# EAGLE design Analog_Slave (EAGLE 7.4.0)
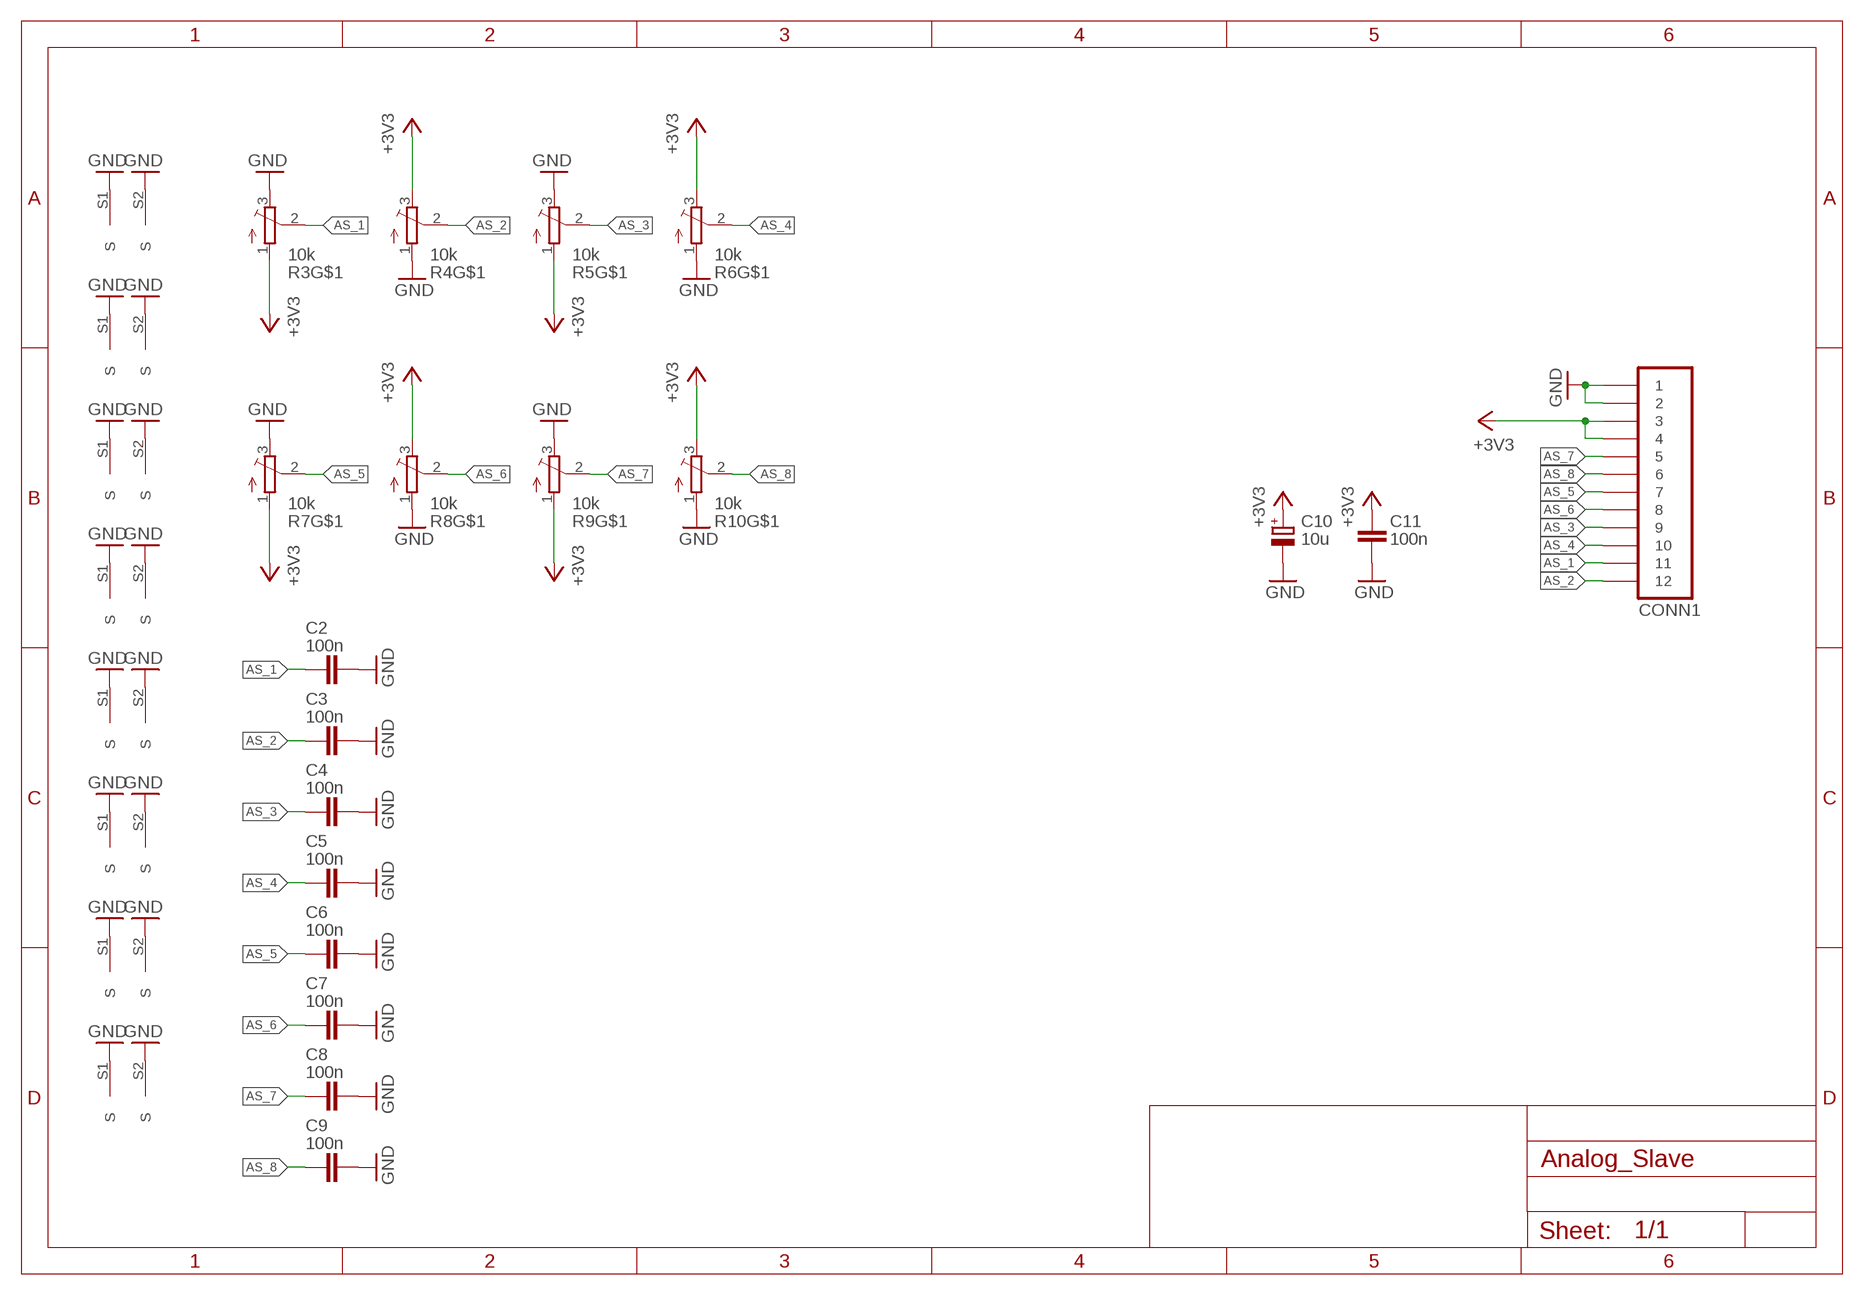
[diagram p0: schematic, sheet 1]

## Parts
C2  100n  CAPACITOR-0805  [C0805]
C3  100n  CAPACITOR-0805  [C0805]
C4  100n  CAPACITOR-0805  [C0805]
C5  100n  CAPACITOR-0805  [C0805]
C6  100n  CAPACITOR-0805  [C0805]
C7  100n  CAPACITOR-0805  [C0805]
C8  100n  CAPACITOR-0805  [C0805]
C9  100n  CAPACITOR-0805  [C0805]
C10  10u  ELECTROLYTIC_CAPACITOR16V-CLV-0405  [153CLV-0405]
C11  100n  CAPACITOR-0805  [C0805]
CONN1  PINHD-2X06-IDC-2.54-V  [IDC-12P-2.54]
R3  10k  PTV09A-4025F-B103  [PTV09A-4025F-B103]
R4  10k  PTV09A-4025F-B103  [PTV09A-4025F-B103]
R5  10k  PTV09A-4025F-B103  [PTV09A-4025F-B103]
R6  10k  PTV09A-4025F-B103  [PTV09A-4025F-B103]
R7  10k  PTV09A-4025F-B103  [PTV09A-4025F-B103]
R8  10k  PTV09A-4025F-B103  [PTV09A-4025F-B103]
R9  10k  PTV09A-4025F-B103  [PTV09A-4025F-B103]
R10  10k  PTV09A-4025F-B103  [PTV09A-4025F-B103]

## Nets
+3V3: C10.+ C11.1 CONN1.3 CONN1.4 R3.1 R4.3 R5.1 R6.3 R7.1 R8.3 R9.1 R10.3
AS_1: C2.1 CONN1.11 R3.2
AS_2: C3.1 CONN1.12 R4.2
AS_3: C4.1 CONN1.9 R5.2
AS_4: C5.1 CONN1.10 R6.2
AS_5: C6.1 CONN1.7 R7.2
AS_6: C7.1 CONN1.8 R8.2
AS_7: C8.1 CONN1.5 R9.2
AS_8: C9.1 CONN1.6 R10.2
GND: C2.2 C3.2 C4.2 C5.2 C6.2 C7.2 C8.2 C9.2 C10.- C11.2 CONN1.1 CONN1.2 R3.3 R3.S1(S) R3.S2(S) R4.1 R4.S1(S) R4.S2(S) R5.3 R5.S1(S) R5.S2(S) R6.1 R6.S1(S) R6.S2(S) R7.3 R7.S1(S) R7.S2(S) R8.1 R8.S1(S) R8.S2(S) R9.3 R9.S1(S) R9.S2(S) R10.1 R10.S1(S) R10.S2(S)

## Library data of the parts
C2-C9 C11 = igor_lbr:CAPACITOR: Capacitor
C10 = igor_lbr:ELECTROLYTIC_CAPACITOR: Electrolytic capacitor; MANUFACTURER: Multicomp; MPN: MCVVT016M100CA1L
CONN1 = igor_lbr:PINHD-2X06: Pin Header
R3-R10 = igor_lbr:PTV09A-4025F-B103: Potentiometer

## Board
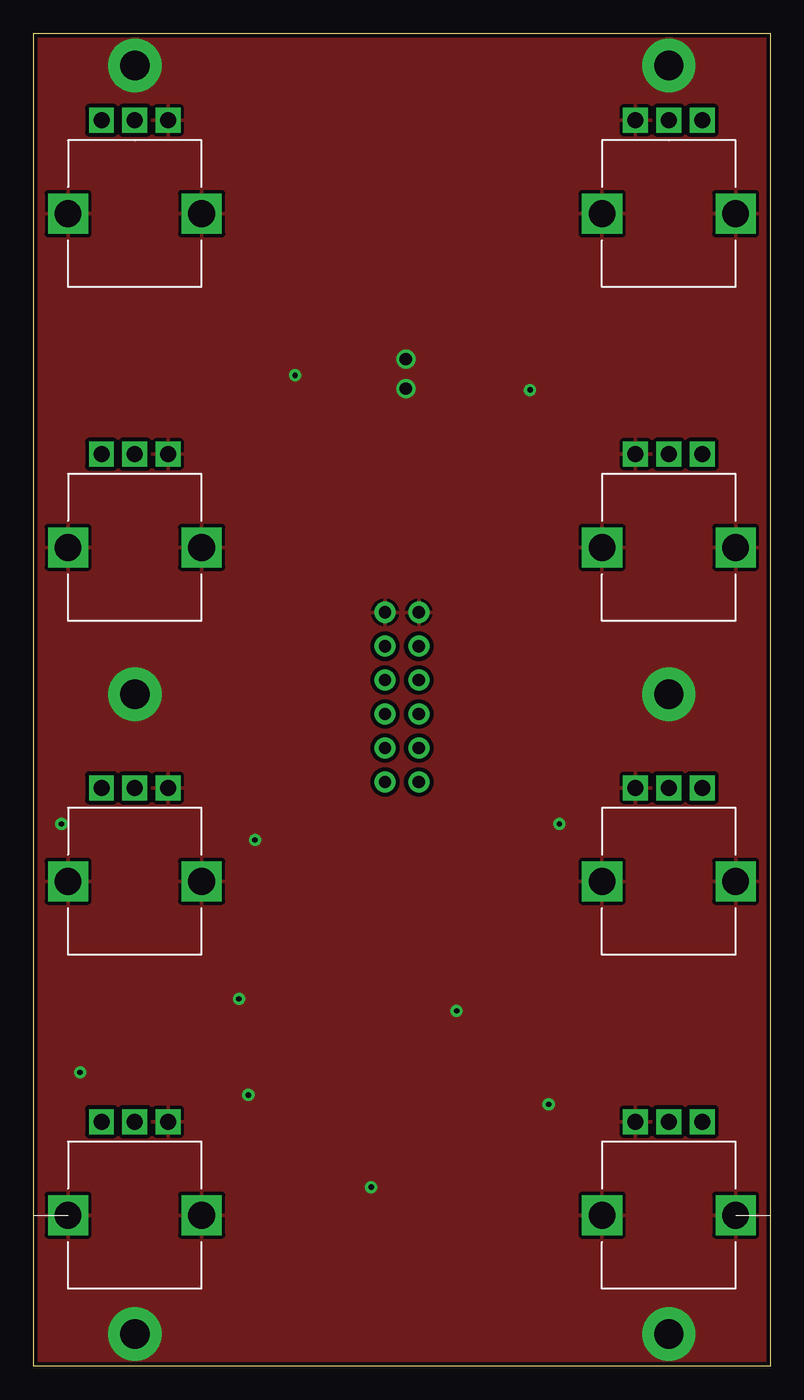
[diagram p1: board, top side]
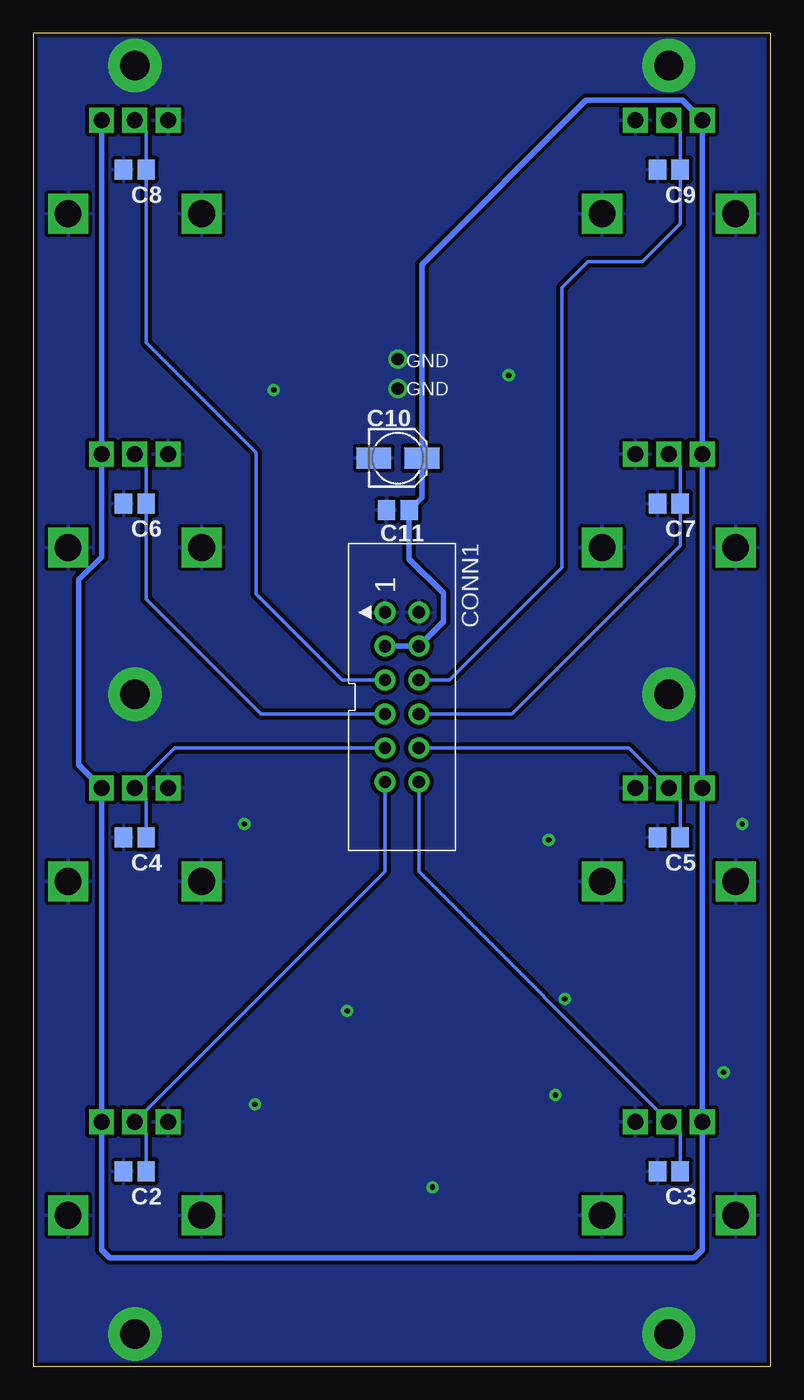
[diagram p2: board, bottom side, seen from below]

Size 55.2 x 99.8 mm. Coordinates in mm from the lower left corner, seen from the top.
Outline: 55.2,0 0,0 0,99.8 55.2,99.8 55.2,0
Copper layers (1*16): Top 0.035mm / dielectric 1.5mm / Bottom 0.035mm
Design rules "smiery": minimum track width 10mil, minimum drill 12mil, track to track 7mil, track to pad 5mil, pad to pad 5mil, via to via 6mil, smd to smd 0mil, copper to edge 12mil, drill to drill 10mil, minimum pad ring 13mil, minimum via ring 10mil, stop-mask expansion 2mil, vias tented up to drill 25mil, thermal gap 10mil

### Footprints (pad centres in the part's own frame; a part is rotated, then mirrored left to right if it is on the bottom)
C0805 = smd 1.3 x 1.5: 1 -0.85,0; 2 0.85,0
153CLV-0405 = smd 2.6 x 1.6: + 1.8,0; - -1.8,0
IDC-12P-2.54 = drill 0.914: 1 -6.35,-1.27; 2 -6.35,1.27; 3 -3.81,-1.27; 4 -3.81,1.27; 5 -1.27,-1.27; 6 -1.27,1.27; 7 1.27,-1.27; 8 1.27,1.27; 9 3.81,-1.27; 10 3.81,1.27; 11 6.35,-1.27; 12 6.35,1.27
PTV09A-4025F-B103 = drill 1.2 square: 1 -2.5,-7; 2 0,-7; 3 2.5,-7 | drill 2 square: S1 -5,0; S2 5,0

### Placement (x,y rotation side)
C2  47.6,14.6 180 bottom
C3  7.6,14.6 180 bottom
C4  47.6,39.6 180 bottom
C5  7.6,39.6 180 bottom
C6  47.6,64.6 180 bottom
C7  7.6,64.6 180 bottom
C8  47.6,89.6 180 bottom
C9  7.6,89.6 180 bottom
C10  27.9,68 0 bottom
C11  27.9,64.1 180 bottom
CONN1  27.6,50.1 270 bottom
R3  47.6,11.3 180 top
R4  7.6,11.3 180 top
R5  47.6,36.3 180 top
R6  7.6,36.3 180 top
R7  47.6,61.3 180 top
R8  7.6,61.3 180 top
R9  47.6,86.3 180 top
R10  7.6,86.3 180 top

### Tracks (layer width: path | path; a pad name or v marks a point on that pad's centre or on a via)
+3V3
  Bottom 0.406: R9.1 R7.1 50.1,60.6 51.8,58.9 51.8,45 R5.1 R3.1 50.1,8.7 49.5,8.1 5.7,8.1 5.1,8.7 R4.3 R6.3 R8.3 R10.3 6.6,94.8 13.8,94.8 26.1,82.5 C10.+ 26.1,65.05 C11.1 27.05,60.45 24.5,57.9 24.5,55.74 CONN1.4 CONN1.3
AS_1
  Bottom 0.254: C2.1 46.75,17.45 R3.2 28.87,37.03 CONN1.11
AS_2
  Bottom 0.254: C3.1 6.75,17.45 R4.2 26.33,37.03 CONN1.12
AS_3
  Bottom 0.254: C4.1 46.75,42.45 R5.2 44.61,46.29 CONN1.9
AS_4
  Bottom 0.254: CONN1.10 10.59,46.29 R6.2 6.75,42.45 C5.1
AS_5
  Bottom 0.254: R7.2 46.75,67.45 C6.1 46.75,57.45 38.13,48.83 CONN1.7
AS_6
  Bottom 0.254: CONN1.8 19.37,48.83 6.75,61.45 C7.1 6.75,67.45 R8.2
AS_7
  Bottom 0.254: R9.2 46.75,92.45 C8.1 46.75,76.65 38.5,68.4 38.5,57.8 32.07,51.37 CONN1.5
AS_8
  Bottom 0.254: R10.2 6.75,92.45 C9.1 6.75,85.55 9.6,82.7 13.65,82.7 15.6,80.75 15.6,59.8 24.03,51.37 CONN1.6
GND  (via drill 0.4 pad 0.6, 0.91, 2.2 pad 4)
  other vias: 19.6,74.2 31.7,26.6 39.4,40.6 37.2,73.1 16.6,39.4 38.6,19.6 2.1,40.6 15.4,27.5 16.1,20.3 3.5,22 25.3,13.4 47.6,2.4 7.6,2.4 7.6,50.3 47.6,50.3 47.6,97.4 7.6,97.4 27.9,73.2 27.9,75.4
  pour Bottom (isolate 0.305): 55.2,99.8 0,99.8 0,0 55.2,0
  pour Top (isolate 0.305): 55.2,99.8 0,99.8 0,0 55.2,0

### Text on the board
bPlace: GND | GND